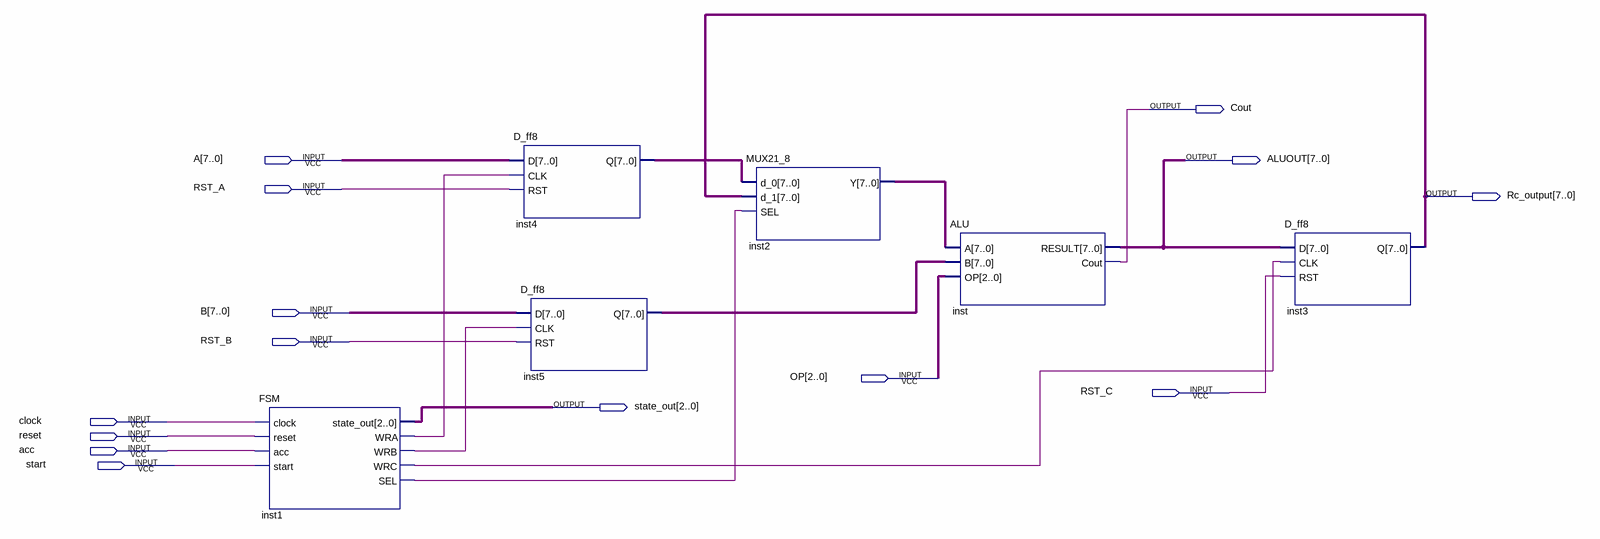
[diagram p0: schematic sheet]
// Quartus schematic ALUProject.bdf as structural Verilog: 6 symbols, 14 pins
module ALUProject (
  input  [7:0] A,
  input  RST_A,
  input  [7:0] B,
  input  RST_B,
  input  [2:0] OP,
  input  RST_C,
  input  clock,
  input  reset,
  input  acc,
  input  start,
  output Cout,
  output [7:0] ALUOUT,
  output [7:0] Rc_output,
  output [2:0] state_out
);

  wire inst1_sel, inst1_wra, inst1_wrb, inst1_wrc;
  wire [7:0] inst2_y, inst4_q, inst5_q;

  FSM inst1 (
    .clock(clock), .reset(reset), .acc(acc), .start(start), .state_out(state_out), .WRA(inst1_wra),
    .WRB(inst1_wrb), .WRC(inst1_wrc), .SEL(inst1_sel));
  D_ff8 inst4 (.D(A), .CLK(inst1_wra), .RST(RST_A), .Q(inst4_q));
  D_ff8 inst5 (.D(B), .CLK(inst1_wrb), .RST(RST_B), .Q(inst5_q));
  MUX21_8 inst2 (.d_0(inst4_q), .d_1(Rc_output), .SEL(inst1_sel), .Y(inst2_y));
  ALU inst (.A(inst2_y), .B(inst5_q), .OP(OP), .RESULT(ALUOUT), .Cout(Cout));
  D_ff8 inst3 (.D(ALUOUT), .CLK(inst1_wrc), .RST(RST_C), .Q(Rc_output));
endmodule
